# Altium schematic sheet LockIn.SchDoc
size A
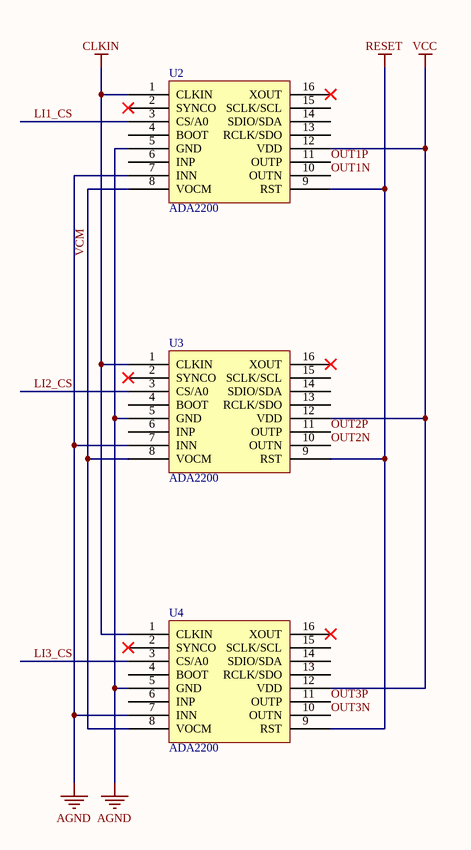
[diagram p0: LockIn.SchDoc]

## Parts
U2  ADA2200  [TSSOP-16]
U3  ADA2200  [TSSOP-16]
U4  ADA2200  [TSSOP-16]

## Nets
AGND: U2.5(GND) U2.7(INN) U3.5(GND) U3.7(INN) U4.5(GND) U4.7(INN)
CLKIN: U2.1(CLKIN) U3.1(CLKIN) U4.1(CLKIN)
RESET: U2.9(RST) U3.9(RST) U4.9(RST)
VCC: U2.12(VDD) U3.12(VDD) U4.12(VDD)
LI1_CS: U2.3(CS/A0)
LI2_CS: U3.3(CS/A0)
LI3_CS: U4.3(CS/A0)
OUT1N: U2.10(OUTN)
OUT1P: U2.11(OUTP)
OUT2N: U3.10(OUTN)
OUT2P: U3.11(OUTP)
OUT3N: U4.10(OUTN)
OUT3P: U4.11(OUTP)
VCM: U2.8(VOCM) U3.8(VOCM) U4.8(VOCM)

Not connected (* = marked no-connect by the designer): U2 2(SYNCO)* 4(BOOT) 6(INP) 13(RCLK/SDO) 14(SDIO/SDA) 15(SCLK/SCL) 16(XOUT)*; U3 2(SYNCO)* 4(BOOT) 6(INP) 13(RCLK/SDO) 14(SDIO/SDA) 15(SCLK/SCL) 16(XOUT)*; U4 2(SYNCO)* 4(BOOT) 6(INP) 13(RCLK/SDO) 14(SDIO/SDA) 15(SCLK/SCL) 16(XOUT)*